# Altium schematic sheet Power.SchDoc
size A
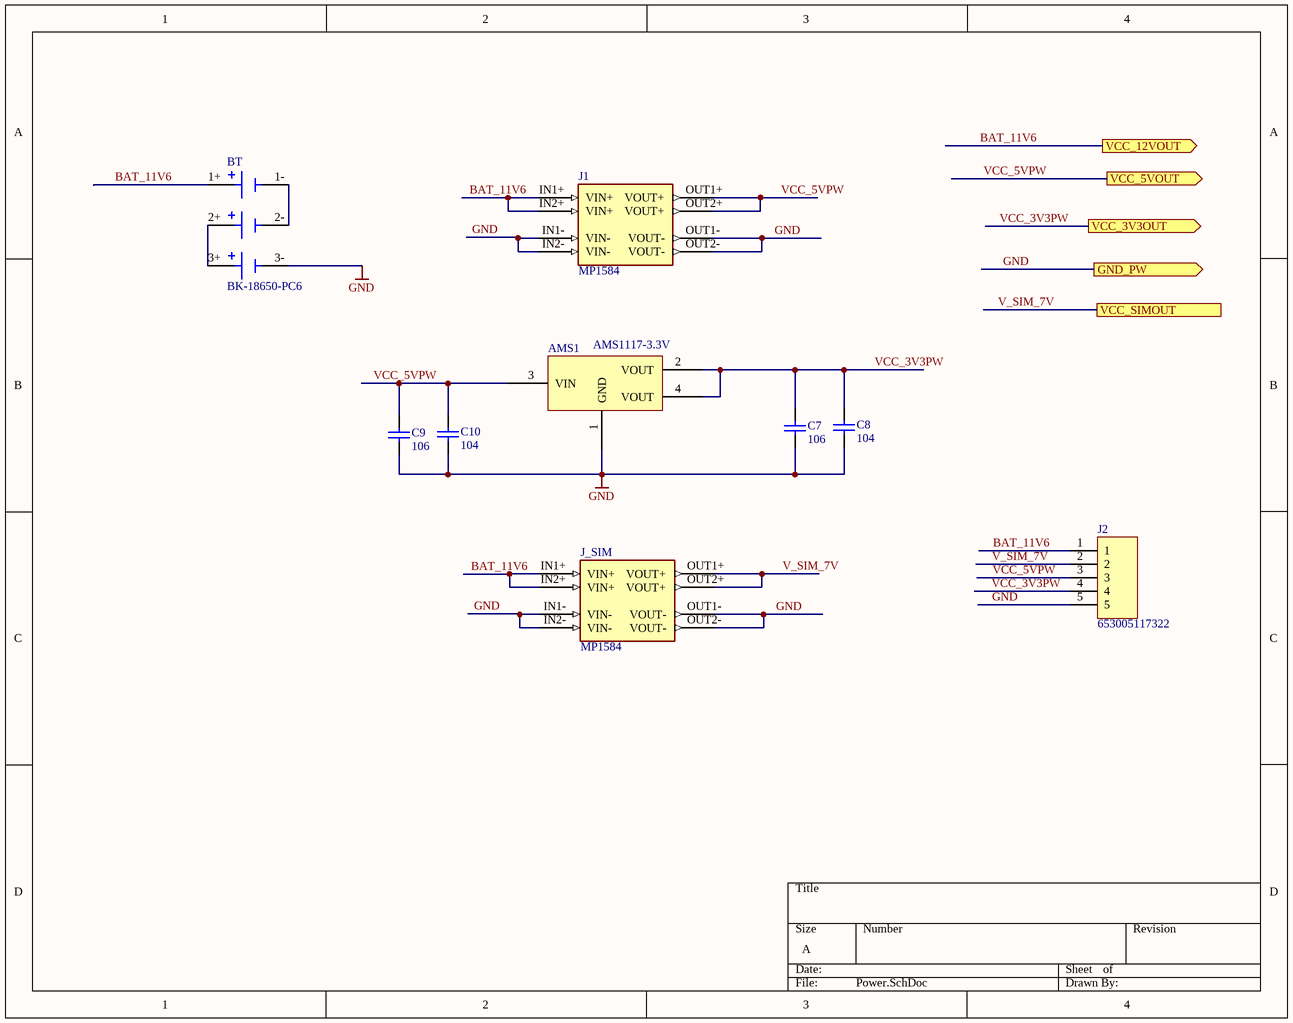
[diagram p0: Power.SchDoc]

## Parts
AMS1  AMS1117-3.3V  [SOT223]
BT  BK-18650-PC6  [BAT_BK-18650-PC6]
C7  106  [tu 0805]
C8  104  [tu 0805]
C9  106  [tu 0805]
C10  104  [tu 0805]
J1  MP1584  [DC-BRICK]
J2  653005117322  [CON5_50_653005117322_TH_RA]
J_SIM  MP1584  [DC-BRICK]

## Ports
GND_PW (out), VCC_3V3OUT (out), VCC_5VOUT (out), VCC_12VOUT (out), VCC_SIMOUT

## Nets
GND: AMS1.1(GND) BT.3- C7.2 C8.2 C9.2 C10.2 J1.IN1-(VIN-) J1.IN2-(VIN-) J1.OUT1-(VOUT-) J1.OUT2-(VOUT-) J2.5 J_SIM.IN1-(VIN-) J_SIM.IN2-(VIN-) J_SIM.OUT1-(VOUT-) J_SIM.OUT2-(VOUT-) ; port GND_PW
BAT_11V6: BT.1+ J1.IN1+(VIN+) J1.IN2+(VIN+) J2.1 J_SIM.IN1+(VIN+) J_SIM.IN2+(VIN+) ; port VCC_12VOUT
V_SIM_7V: J2.2 J_SIM.OUT1+(VOUT+) J_SIM.OUT2+(VOUT+) ; port VCC_SIMOUT
VCC_3V3PW: AMS1.2(VOUT) AMS1.4(VOUT) C7.1 C8.1 J2.4 ; port VCC_3V3OUT
VCC_5VPW: AMS1.3(VIN) C9.1 C10.1 J1.OUT1+(VOUT+) J1.OUT2+(VOUT+) J2.3 ; port VCC_5VOUT
NetBT_1-: BT.1- BT.2-
NetBT_2+: BT.2+ BT.3+

## Library data of the parts
AMS1 = AMS1117 SMD: Dán; Value: AMS1117-3.3V SOT223; Don_Vi: Con; Ma_Hang: MH000596; Ghi_Chu: *; Kieu_Chan: *; Chung_Loai: Dán
BT = BK-18650-PC6: Battery Holder _Open_ 18650 3 Cell PC Pin; MF: MPD; Price: None; Package: None; Availability: Unavailable; SnapEDA_Link: https://www.snapeda.com/parts/BK-18650-PC6/MPD/view-part/4480464/?ref=snap; Value: *; MP: BK-18650-PC6
C7 C9 = Tu 0805 106 16V 10%: Dán; Ten_Linh_Kien: Tụ 0805 106-10uF 10% 16V; So_Chan: 2; Don_Vi: Con; Ma_Hang: MH004553; Chung_Loai: Dán; Kieu_Chan: *
C8 C10 = Tu 0805 104 50V 10%: Dán; Don_Vi: Con; So_Chan: 2; Ten_Linh_Kien: Tụ 0805 104-100nF 10% 50V; Ma_Hang: MH004551; Chung_Loai: Dán; Kieu_Chan: *
J1 J_SIM = MP1584: Buck Switching Regulator IC Positive Adjustable 0.8V 1 Output 3A 8-SOIC (0.154, 3.90mm Width) Exposed Pad; MF: Monolithic Power; SnapEDA_Link: https://www.snapeda.com/parts/MP1584/Monolithic+Power+Systems+Inc./view-part/?ref=snap; Package: SOIC-8 Monolithic Power; Value: *; MP: MP1584; Check_prices: https://www.snapeda.com/parts/MP1584/Monolithic+Power+Systems+Inc./view-part/?ref=eda
J2 = CON-PLG_5X1-50-RA-TH: 5 Pins, 1 Row 1.25mm Pitch, right angle Connector, male; Manufacturer: JST; Mating Part Number: 653005113322; Crimp Part Number: 653153128130; Alternate Part Number-1: NA; Manufacturer Part Number: 653005117322; Case/Package: TH-CON; Supplier-1: WURTH; Supplier Part Number-1: 653005117322